# Altium schematic sheet ao.SchDoc
size A3; SheetNumber: 2; SheetTotal: 2
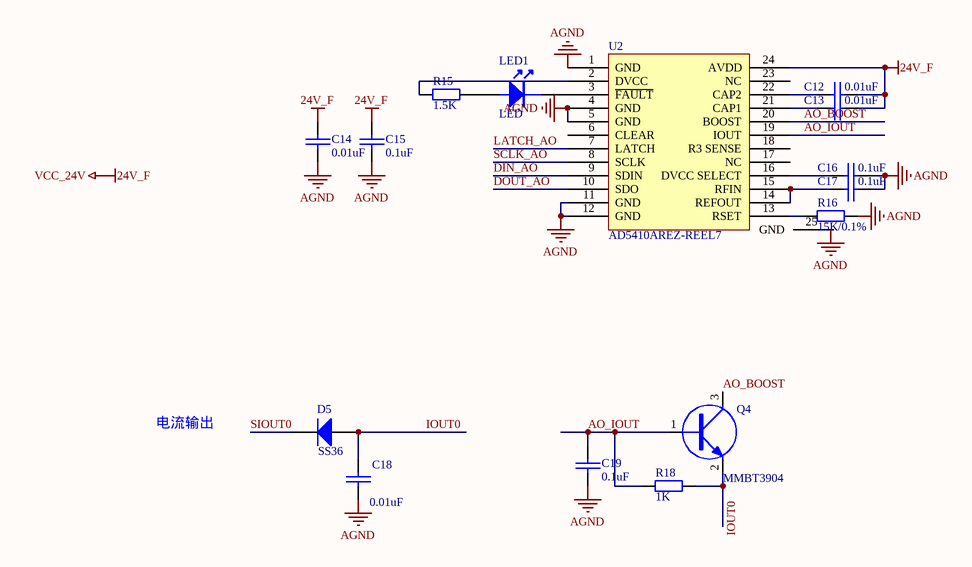
[diagram p0: ao.SchDoc]

## Parts
C12  0.01uF  [0603C]  (no BOM)
C13  0.01uF  [0603C]  (no BOM)
C14  0.01uF  [0603C]  (no BOM)
C15  0.1uF  [0603C]  (no BOM)
C16  0.1uF  [0603C]  (no BOM)
C17  0.1uF  [0603C]  (no BOM)
C18  0.01uF  [0603C]  (no BOM)
C19  0.1uF  [0603C]  (no BOM)
D5  SS36  [sma]  (no BOM)
LED1  LED  [0603LED]  (no BOM)
Q4  MMBT3904  [SOT23-3]  (no BOM)
R15  1.5K  [0603R]  (no BOM)
R16  15K/0.1%  [0603R]  (no BOM)
R18  1K  [0603R]  (no BOM)
U2  AD5410AREZ-REEL7  [AD5410AREZ-REEL7]  (no BOM)

## Nets
24V_F: C12.2 C13.2 C14.2 C15.2 U2.24(AVDD)  [also labelled VCC_24V]
AGND: C14.1 C15.1 C16.2 C17.2 C18.1 C19.1 R16.2 U2.1(GND) U2.4(GND) U2.5(GND) U2.11(GND) U2.12(GND)
AO_BOOST: Q4.3(C) U2.20(BOOST)
AO_IOUT: C19.2 Q4.1(B) R18.1 U2.19(IOUT)
DIN_AO: U2.9(SDIN)
DOUT_AO: U2.10(SDO)
IOUT0: C18.2 D5.1(A) Q4.2(E) R18.2
LATCH_AO: U2.7(LATCH)
SCLK_AO: U2.8(SCLK)
SIOUT0: D5.2(K)
NetC12_1: C12.1 U2.22(CAP2)
NetC13_1: C13.1 U2.21(CAP1)
NetC16_1: C16.1 U2.16(DVCC_SELECT)
NetC17_1: C17.1 U2.14(REFOUT) U2.15(RFIN)
NetLED1_1: LED1.1 R15.2
NetLED1_2: LED1.2 U2.3(~{FAULT})
NetR15_1: R15.1 U2.2(DVCC)
NetR16_1: R16.1 U2.13(RSET)

Not connected (* = marked no-connect by the designer): U2 6(CLEAR) 17(NC) 18(R3_SENSE) 23(NC) 25(GND)

## Notes on the sheet
- 电流输出
- Labels drawn without touching a wire or pin: AGND

## Library data of the parts
C12-C19 = CAP: Capacitor
D5 = Diode 1N4001: 1 Amp General Purpose Rectifier; Published: 8-Jun-2000; LatestRevisionDate: 17-Jul-2002; LatestRevisionNote: Re-released for DXP Platform.; DatasheetVersion: 1998; PackageVersion: Aug-1999; PackageReference: DO-41; Publisher: Altium Limited; Code_JEDEC: DO-204-AL; ComponentLink1Description: Manufacturer Link; ComponentLink1URL: http://www.fairchildsemi.com/; ComponentLink2Description: Datasheet; ComponentLink2URL: http://www.fairchildsemi.com/ds/1N%2F1N4001.pdf
Q4 = NPN_MMBT3904
R15 R16 R18 = Res0805M